# Altium project yard-ice-2.PrjPCB
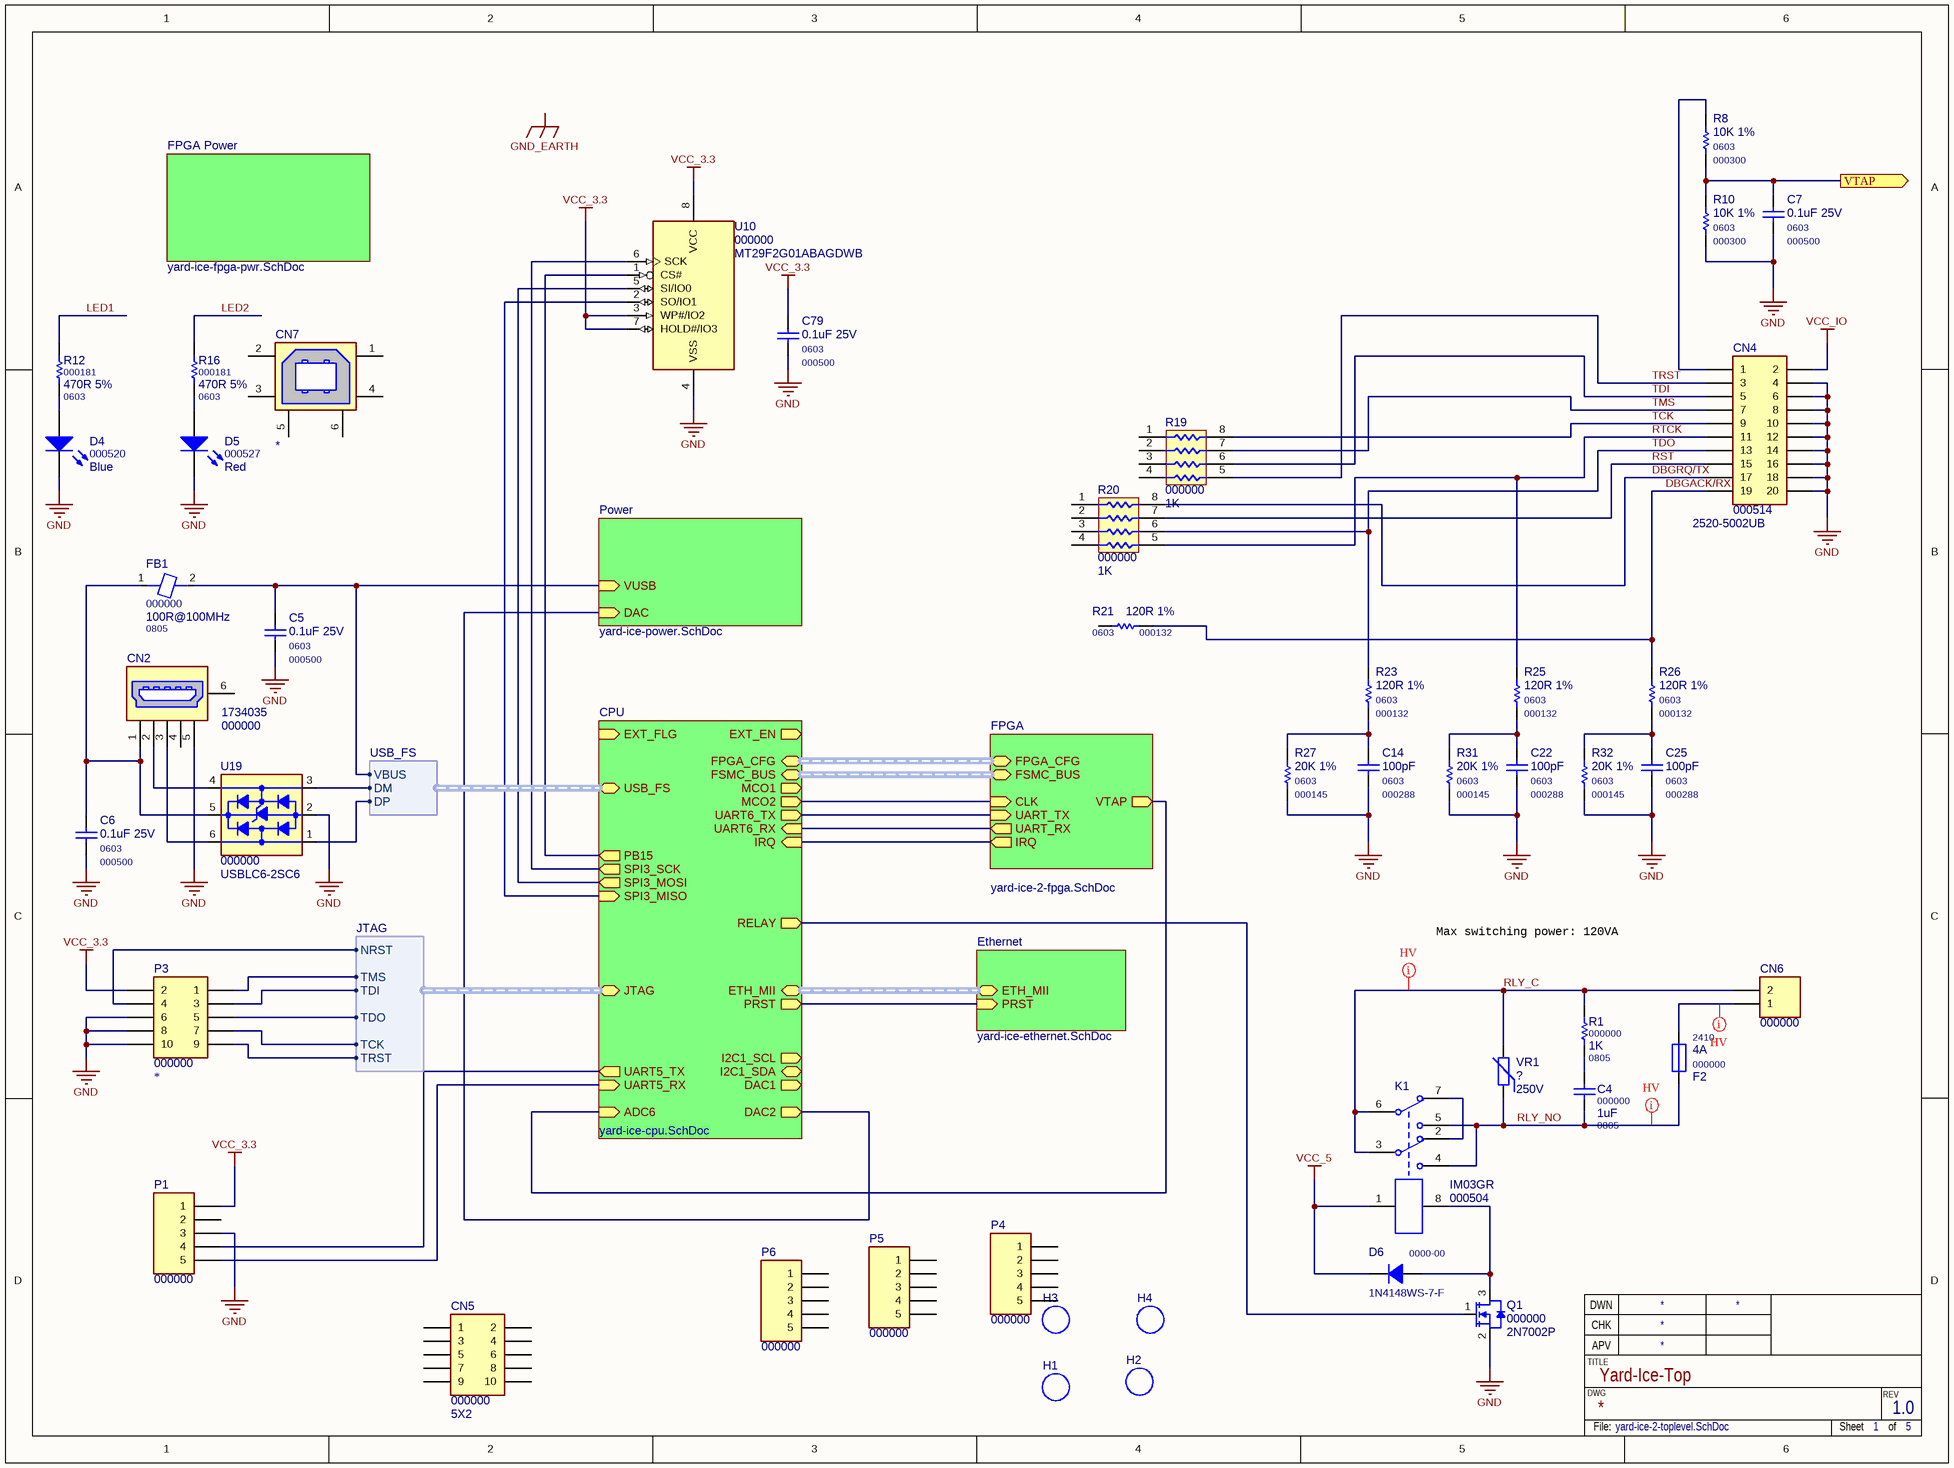
[diagram p0: yard-ice-2-toplevel.SchDoc]
5 sheets, 112 parts. Net scope: hierarchical (ports join the sheet entries above them; power ports are global).
Board file: yard-ice-2.PcbDoc
Sheets:
  yard-ice-2-toplevel.SchDoc
    CPU = yard-ice-cpu.SchDoc
    FPGA = yard-ice-2-fpga.SchDoc
    FPGA Power = yard-ice-fpga-pwr.SchDoc
  yard-ice-change-log.SchDoc

## Sheet yard-ice-2-toplevel.SchDoc: Yard-Ice-Top
size 365 x 274 mm; Revision: 1.0; SheetNumber: 1; SheetTotal: 5

### Parts
C4  000000  value 1uF  Package: 0805  [C0805HV]
C5  000500  value 0.1uF 25V  Package: 0603  [C0603M]
C6  000500  value 0.1uF 25V  Package: 0603  [C0603M]
C7  000500  value 0.1uF 25V  Package: 0603  [C0603M]
C14  000288  value 100pF  Package: 0603  [C0603M]
C22  000288  value 100pF  Package: 0603  [C0603M]
C25  000288  value 100pF  Package: 0603  [C0603M]
C79  000500  value 0.1uF 25V  Package: 0603  [C0603M]
CN2  value 1734035  [1734035]  (hidden comment: 000000)
CN4  000514  value 2520-5002UB  [TST-110-04-G-D-RA]
CN5  000000  value 5X2  [TST-105-04-G-D-RA]
CN6  000000  [691322110002]
CN7  *  [4-1734376]
D4  000520  value Blue  [LED0805L LP]
D5  000527  value Red  [LED0805L LP]
D6  0000-00  MF PN: 1N4148WS-7-F  [SOD-323-M]
F2  000000  value 4A  Package: 2410  [F2410]
FB1  000000  value 100R@100MHz  Package: 0805  [L0805M]
H1  Hole Non Plated  [Hole NP 3.2x5.0x5.0]  (value not drawn)
H2  Hole Non Plated  [Hole NP 3.2x5.0x5.0]  (value not drawn)
H3  Hole Non Plated  [Hole NP 3.2x5.0x5.0]  (value not drawn)
H4  Hole Non Plated  [Hole NP 3.2x5.0x5.0]  (value not drawn)
K1  000504  value IM03GR  [Relay-10X6]
P1  000000  [TSW-105-07-G-S]
P3  000000  [TSW-105-07-G-D]
P4  000000  [TSW-105-07-G-S]
P5  000000  [TSW-105-07-G-S]
P6  000000  [TSW-105-07-G-S]
Q1  000000  value 2N7002P  [SOT-23-M]
R1  000000  value 1K  Package: 0805  [R0805HV]
R8  000300  value 10K 1%  Package: 0603  [R0603M]
R10  000300  value 10K 1%  Package: 0603  [R0603M]
R12  000181  value 470R 5%  Package: 0603  [R0603M]
R16  000181  value 470R 5%  Package: 0603  [R0603M]
R19  000000  value 1K  [R0603x4L]
R20  000000  value 1K  [R0603x4L]
R21  000132  value 120R 1%  Package: 0603  [R0603M]
R23  000132  value 120R 1%  Package: 0603  [R0603M]
R25  000132  value 120R 1%  Package: 0603  [R0603M]
R26  000132  value 120R 1%  Package: 0603  [R0603M]
R27  000145  value 20K 1%  Package: 0603  [R0603M]
R31  000145  value 20K 1%  Package: 0603  [R0603M]
R32  000145  value 20K 1%  Package: 0603  [R0603M]
U10  000000  value MT29F2G01ABAGDWB  [U-PDFN-8]
U19  000000  value USBLC6-2SC6  [SOT23-6L]
VR1  ?  value 250V  [MOV7x4.8-5.0]

### Sub-sheets
CPU = yard-ice-cpu.SchDoc: ETH_MII (harness ETH_MII), FSMC_BUS (harness FSMC_BUS), FPGA_CFG (harness FPGA_CFG), PRST (out), MCO2 (out), USB_FS (harness USB_FS), JTAG (harness JTAG), EXT_EN (out), EXT_FLG (in), ADC6 (in), DAC2 (out), I2C1_SDA (bidir), I2C1_SCL (out), UART6_TX (out), UART6_RX (in), UART5_TX (out), UART5_RX (in), RELAY (out), IRQ (in), DAC1 (out), SPI3_MISO (in), SPI3_MOSI (out), SPI3_SCK (out), PB15 (out), MCO1 (out)
Ethernet = yard-ice-ethernet.SchDoc (file not in this document): ETH_MII (harness ETH_MII), PRST (in)
FPGA = yard-ice-2-fpga.SchDoc: FSMC_BUS (harness FSMC_BUS), FPGA_CFG (harness FPGA_CFG), CLK (in), VTAP (out), UART_TX (in), UART_RX (out), IRQ (out)
FPGA Power = yard-ice-fpga-pwr.SchDoc: no entries
Power = yard-ice-power.SchDoc (file not in this document): VUSB (in), DAC (in)

### Ports
VTAP (out)

### Harnesses
USB_FS: VBUS, DM, DP
JTAG: TDO, TDI, TCK, TMS, TRST, NRST

### Nets
GND: C5.2 C6.2 C7.2 C14.2 C22.2 C25.2 C79.2 CN2.5(SHIELD) CN4.4 CN4.6 CN4.8 CN4.10 CN4.12 CN4.14 CN4.16 CN4.18 CN4.20 D4.2(K) D5.2(K) P1.3 P3.6 P3.8 P3.10 Q1.2(S) R10.2 R27.2 R31.2 R32.2 U10.4(VSS) U19.2(GND)
VCC_3.3: C79.1 P1.1 P3.2 U10.3(WP#/IO2) U10.7(HOLD#/IO3) U10.8(VCC)
VCC_5: D6.2(K) K1.1
VCC_IO: CN4.2
ADC12_IN6: sheet CPU/ADC6, sheet FPGA/VTAP
DAC2_OUT: sheet Power/DAC, sheet CPU/DAC2
DBGACK/RX: CN4.19 R21.1 R26.1
DBGRQ/TX: CN4.17 R20.8
IRQ: sheet CPU/IRQ, sheet FPGA/IRQ
JTCK: P3.7 ; sheet CPU/JTAG.TCK
JTDI: P3.3 ; sheet CPU/JTAG.TDI
JTDO: P3.5 ; sheet CPU/JTAG.TDO
JTMS: P3.1 ; sheet CPU/JTAG.TMS
JTRST: P3.9 ; sheet CPU/JTAG.TRST
LED1: R12.1
LED2: R16.1
NRST: P3.4 ; sheet CPU/JTAG.NRST
OTG_FS_DM: U19.3(IO/2) ; sheet CPU/USB_FS.DM
OTG_FS_DP: U19.1(IO/1) ; sheet CPU/USB_FS.DP
OTG_FS_VBUS: C5.1 FB1.2 ; sheet Power/VUSB, sheet CPU/USB_FS.VBUS
PC13: sheet CPU/PRST, sheet Ethernet/PRST
RLY_C: CN6.2 K1.3 K1.6 R1.2 VR1.2
RLY_NO: C4.2 F2.1 K1.4 K1.5 VR1.1
RST: CN4.15 R20.7
RTCK: CN4.11 R20.5 R25.1
SDIO_CK: U10.5(SI/IO0) ; sheet CPU/SPI3_MOSI
SDIO_D1: sheet CPU/MCO2, sheet FPGA/CLK
SDIO_D2: U10.6(SCK) ; sheet CPU/SPI3_SCK
SDIO_D3: U10.2(SO/IO1) ; sheet CPU/SPI3_MISO
SPI2_NSS: Q1.1(G) ; sheet CPU/RELAY
TCK: CN4.9 R19.8
TDI: CN4.5 R19.6
TDO: CN4.13 R20.6 R23.1
TMS: CN4.7 R19.7
TRST: CN4.3 R19.5
USART6_RX: sheet CPU/UART6_RX, sheet FPGA/UART_RX
USART6_TX: sheet CPU/UART6_TX, sheet FPGA/UART_TX
NetC4_1: C4.1 R1.1
NetC6_1: C6.1 CN2.1 FB1.1 U19.5(VBUS)
NetC7_1: C7.1 R8.2 R10.1 ; port VTAP
NetC14_1: C14.1 R23.2 R27.1
NetC22_1: C22.1 R25.2 R31.1
NetC25_1: C25.1 R26.2 R32.1
NetCN2_2: CN2.2 U19.4(I/O2)
NetCN2_3: CN2.3 U19.6(I/O1)
NetCN4_1: CN4.1 R8.1
NetCN6_1: CN6.1 F2.2
NetD4_1: D4.1(A) R12.2
NetD5_1: D5.1(A) R16.2
NetD6_1: D6.1(A) K1.8 Q1.3(D)
NetK1_2: K1.2 K1.7
NetP1_4: P1.4 ; sheet CPU/UART5_TX
NetP1_5: P1.5 ; sheet CPU/UART5_RX
NetU10_1: U10.1(CS#) ; sheet CPU/PB15

Not connected (* = marked no-connect by the designer): CN2 4 6(SHIELD); CN5 1 2 3 4 5 6 7 8 9 10; CN7 1 2 3 4 5(SHIELD) 6(SHIELD); P1 2; P4 1 2 3 4 5; P5 1 2 3 4 5; P6 1 2 3 4 5; R19 1 2 3 4; R20 1 2 3 4; R21 2

### Buses and harness runs
harness sheet CPU/ETH_MII = sheet Ethernet/ETH_MII
harness sheet CPU/FPGA_CFG = sheet FPGA/FPGA_CFG
harness sheet CPU/FSMC_BUS = sheet FPGA/FSMC_BUS

### Layout directives
net class HV: NetCN6_1, RLY_C, RLY_NO

### Notes on the sheet
- Max switching power: 120VA
- Labels drawn without touching a wire or pin: GND_EARTH
- TITLE
- CHK
- DWN
- APV
- DWG
- REV
- File:
- Sheet
- of

### Library data of the parts
C4 = C0805: SMD Ceramic Chip Capacitor - 0805; PN: 000000; ExtraInfo: *
C5-C7 C79 = C0603: SMD Ceramic Chip Capacitor - 0603 - X7R; MF PN: C1608X7R1E104K; MF: TDK; PN: 000500
C14 C22 C25 = C0603: SMD Ceramic Chip Capacitor - 0603; PN: 000288
CN2 = 1734035: USB Type B Mini - Right Angle - SMD; MF: Tyco; MF PN: 1734035-3; Package: SMT; PN: 000000; Digi-Key PN: A121553CT-ND; Price: 1.16131; Status: Stock
CN4 = Header 10X2: Shrouded Header, 20 Pos, Right Angle; MF: 3M; PN: 000514; Package: PTH; MF PN: 2520-5002UB
CN5 = Header 5X2: Socket 5-Pin, Dual row; MF: Samtec; PN: 000000; Package: SMD; ExtraInfo: *
CN6 = Term Blk 2: Terminal Block, Header, 2-Pos; PN: 000000; Package: PTH; Value: *; ExtraInfo: *
CN7 = 4-1734376: USB Type B - Right Angle - Thru Hole; PN: *; Value: *; Package: *; ExtraInfo: *
D4 D5 = LED0805LP: LED SMD 0805; Package: 0805
  D4: PN: 000520
  D5: PN: 000527
D6 = 1N4148WS: Fast Switching Diode 100V 150mA; MF: Diodes Inc; PN: 0000-00; Package: SOD-323; ExtraInfo: *
F2 = F2410: PN: 000000; ExtraInfo: *; MF: *; MF PN: *
FB1 = FB0805: SMD Chip Ferrite Bead - 0805; PN: 000000; ExtraInfo: *; MF: *; MF PN: *
K1 = Relay-DPDT: Dual-Pole Dual-Throw Relay; MF: Tyco; PN: 000504; Package: SMT; MF PN: IM03GR
P1 P4-P6 = Header 5: Header, 5-Pin; Value: 5x1; PN: 000000; Package: PTH
P3 = Header 5X2: Socket 5-Pin, Dual row; PN: 000000; Package: SMD; Value: *; ExtraInfo: *
Q1 = 2N7002P: N-Channel MOSFET 60V 360mA SOT-23; PN: 000000; Package: SOT-23; ExtraInfo: *
R1 = R0805: SMD Chip Resistor - 0805; PN: 000000; ExtraInfo: *
R8 R10 R12 R16 R21 R23 R25-R27 R31 R32 = R0603: SMD Chip Resistor - 0603
  R8 R10: PN: 000300
  R12 R16: PN: 000181
  R21 R23 R25 R26: PN: 000132
  R27 R31 R32: PN: 000145
R19 R20 = R0603x4: SMD Chip Resistor Array - 4x0603; PackageReference: 4x0402; PN: 000000; ExtraInfo: *; Package: 0603
U10 = MT29F2G01ABAGDWB: 2Gb NANDl Flash Memory,  133MHz, SPI; MF: Micron; MF PN: MT29F2G01ABAGDWB-IT:G TR; PN: 000000; Package: 8VDFN; ExtraInfo: *; Digi-Key PN: 557-1664-1-ND; Price: 3.52500
U19 = USBLC6-2SC6: USB ESD Protection; PN: 0000-00; MF: STMicroelectronics; Package: ST23-6L; ExtraInfo: *; Digi-Key PN: 497-5235-1-ND; MF PN: USBLC6-2SC6; Price: 0.14025; Status: Stock
VR1 = Varistor: Varistor (Voltage-Sensitive Resistor); PN: ?; MF PN: *; Package: PTH; ExtraInfo: *; MF: *; Price: *; Digi-Key PN: *

## Sheet yard-ice-cpu.SchDoc: Yard-Ice-CPU
size 365 x 274 mm; Revision: 1.0; SheetNumber: 3; SheetTotal: 5
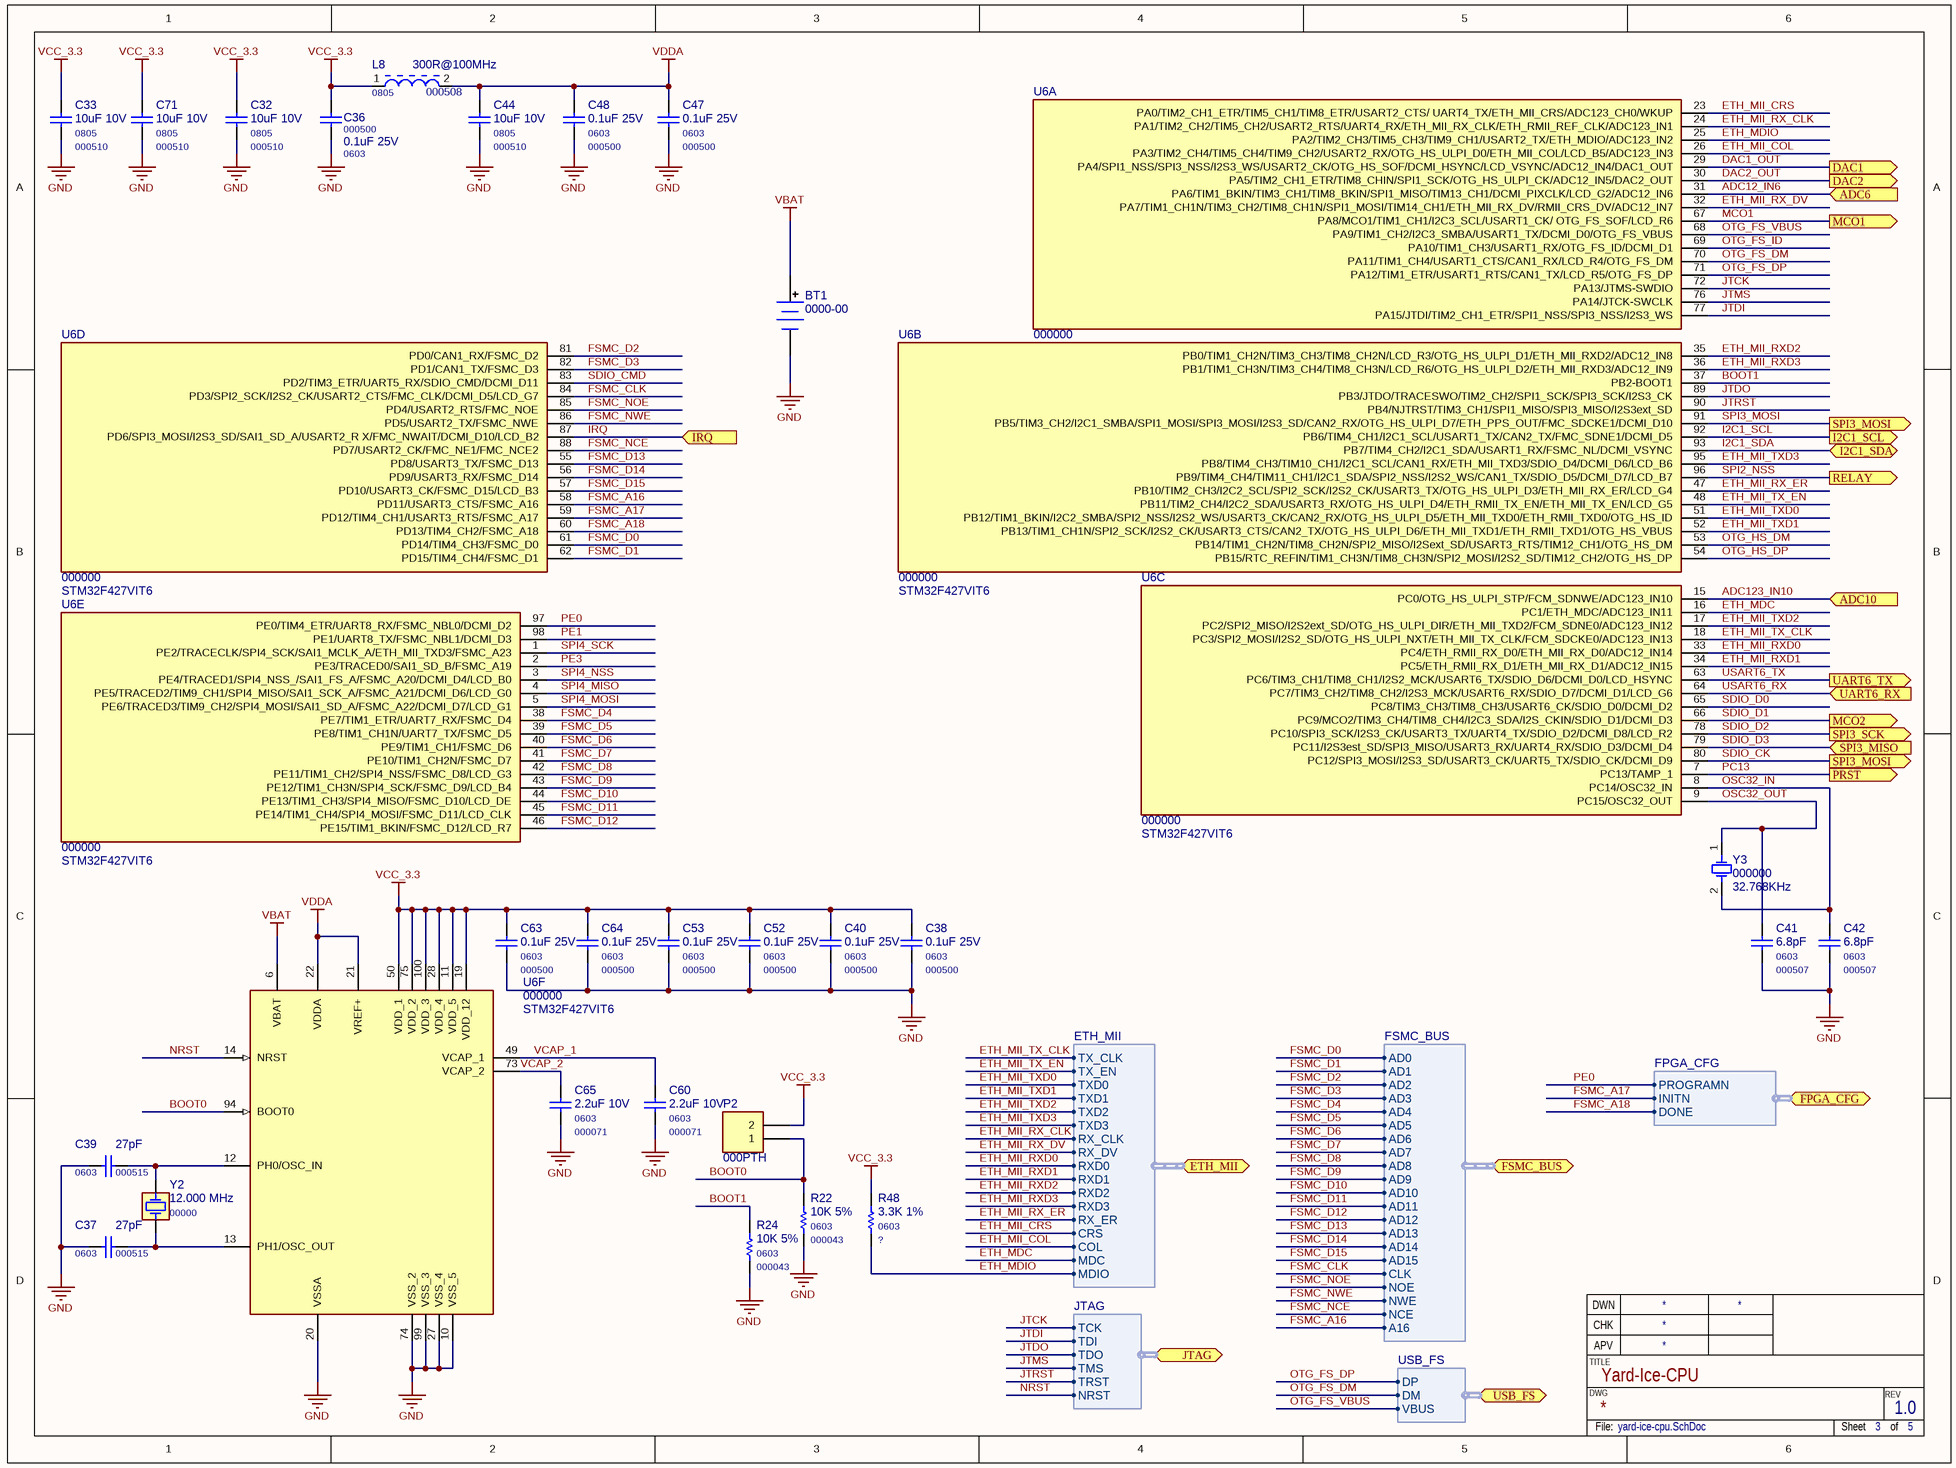
[diagram p1: yard-ice-cpu.SchDoc]

### Parts
BT1  0000-00  [CR-1632/VCN]
C32  000510  value 10uF 10V  Package: 0805  [C0805M]
C33  000510  value 10uF 10V  Package: 0805  [C0805M]
C36  000500  value 0.1uF 25V  Package: 0603  [C0603M]
C37  000515  value 27pF  Package: 0603  [C0603M]
C38  000500  value 0.1uF 25V  Package: 0603  [C0603M]
C39  000515  value 27pF  Package: 0603  [C0603M]
C40  000500  value 0.1uF 25V  Package: 0603  [C0603M]
C41  000507  value 6.8pF  Package: 0603  [C0603M]
C42  000507  value 6.8pF  Package: 0603  [C0603M]
C44  000510  value 10uF 10V  Package: 0805  [C0805M]
C47  000500  value 0.1uF 25V  Package: 0603  [C0603M]
C48  000500  value 0.1uF 25V  Package: 0603  [C0603M]
C52  000500  value 0.1uF 25V  Package: 0603  [C0603M]
C53  000500  value 0.1uF 25V  Package: 0603  [C0603M]
C60  000071  value 2.2uF 10V  Package: 0603  [C0603M]
C63  000500  value 0.1uF 25V  Package: 0603  [C0603M]
C64  000500  value 0.1uF 25V  Package: 0603  [C0603M]
C65  000071  value 2.2uF 10V  Package: 0603  [C0603M]
C71  000510  value 10uF 10V  Package: 0805  [C0805M]
L8  000508  value 300R@100MHz  Package: 0805  [L0805M]
P2  000PTH  [TSW-102-07-G-S]
R22  000043  value 10K 5%  Package: 0603  [R0603M]
R24  000043  value 10K 5%  Package: 0603  [R0603M]
R48  ?  value 3.3K 1%  Package: 0603  [R0603M]
U6  000000  value STM32F427VIT6  [LQFP100]  (parts A,B,C,D,E,F of 6)
Y2  00000  value 12.000 MHz  [ABM3-H]
Y3  000000  value 32.768KHz  [CA-301-V]

### Ports
ADC6 (in), ADC10 (in), DAC1 (out), DAC2 (out), ETH_MII (harness ETH_MII), FPGA_CFG (harness FPGA_CFG), FSMC_BUS (harness FSMC_BUS), I2C1_SCL (out), I2C1_SDA (bidir), IRQ (in), JTAG (harness JTAG), MCO1 (out), MCO2 (out), PRST (out), RELAY (out), SPI3_MISO (in), SPI3_MOSI (out), SPI3_SCK (out), UART6_RX (in), UART6_TX (out), USB_FS (harness USB_FS)

### Harnesses
ETH_MII: TX_CLK, TX_EN, TXD0, TXD1, TXD2, TXD3, RX_CLK, RX_DV, RXD0, RXD1, RXD2, RXD3, RX_ER, CRS, COL, MDC, MDIO
FSMC_BUS: AD0, AD1, AD2, AD3, AD4, AD5, AD6, AD7, AD8, AD9, AD10, AD11, AD12, AD13, AD14, AD15, CLK, NOE, NWE, NCE, A16
USB_FS: VBUS, DM, DP
JTAG: TDO, TDI, TCK, TMS, TRST, NRST
FPGA_CFG: DONE, INITN, PROGRAMN

### Nets
GND: BT1.2(-) C32.2 C33.2 C36.2 C37.1 C38.2 C39.1 C40.2 C41.1 C42.1 C44.2 C47.2 C48.2 C52.2 C53.2 C60.2 C63.2 C64.2 C65.2 C71.2 R22.1 R24.1 U6.10(VSS_5) U6.20(VSSA) U6.27(VSS_4) U6.74(VSS_2) U6.99(VSS_3)
VBAT: BT1.1(+) U6.6(VBAT)
VCC_3.3: C32.1 C33.1 C36.1 C38.1 C40.1 C52.1 C53.1 C63.1 C64.1 C71.1 L8.1 P2.2 R48.2 U6.11(VDD_5) U6.19(VDD_12) U6.28(VDD_4) U6.50(VDD_1) U6.75(VDD_2) U6.100(VDD_3)
VDDA: C44.1 C47.1 C48.1 L8.2 U6.21(VREF+) U6.22(VDDA)
ADC12_IN6: U6.31(PA6/TIM1_BKIN/TIM3_CH1/TIM8_BKIN/SPI1_MISO/TIM13_CH1/DCMI_PIXCLK/LCD_G2/ADC12_IN6) ; port ADC6
ADC123_IN10: U6.15(PC0/OTG_HS_ULPI_STP/FCM_SDNWE/ADC123_IN10) ; port ADC10
BOOT0: P2.1 R22.2 U6.94(BOOT0)
BOOT1: R24.2 U6.37(PB2-BOOT1)
DAC1_OUT: U6.29(PA4/SPI1_NSS/SPI3_NSS/I2S3_WS/USART2_CK/OTG_HS_SOF/DCMI_HSYNC/LCD_VSYNC/ADC12_IN4/DAC1_OUT) ; port DAC1
DAC2_OUT: U6.30(PA5/TIM2_CH1_ETR/TIM8_CHIN/SPI1_SCK/OTG_HS_ULPI_CK/ADC12_IN5/DAC2_OUT) ; port DAC2
ETH_MDC: U6.16(PC1/ETH_MDC/ADC123_IN11) ; port ETH_MII.MDC
ETH_MDIO: R48.1 U6.25(PA2/TIM2_CH3/TIM5_CH3/TIM9_CH1/USART2_TX/ETH_MDIO/ADC123_IN2) ; port ETH_MII.MDIO
ETH_MII_COL: U6.26(PA3/TIM2_CH4/TIM5_CH4/TIM9_CH2/USART2_RX/OTG_HS_ULPI_D0/ETH_MII_COL/LCD_B5/ADC123_IN3) ; port ETH_MII.COL
ETH_MII_CRS: U6.23(PA0/TIM2_CH1_ETR/TIM5_CH1/TIM8_ETR/USART2_CTS/_UART4_TX/ETH_MII_CRS/ADC123_CH0/WKUP) ; port ETH_MII.CRS
ETH_MII_RX_CLK: U6.24(PA1/TIM2_CH2/TIM5_CH2/USART2_RTS/UART4_RX/ETH_MII_RX_CLK/ETH_RMII_REF_CLK/ADC123_IN1) ; port ETH_MII.RX_CLK
ETH_MII_RX_DV: U6.32(PA7/TIM1_CH1N/TIM3_CH2/TIM8_CH1N/SPI1_MOSI/TIM14_CH1/ETH_MII_RX_DV/RMII_CRS_DV/ADC12_IN7) ; port ETH_MII.RX_DV
ETH_MII_RX_ER: U6.47(PB10/TIM2_CH3/I2C2_SCL/SPI2_SCK/I2S2_CK/USART3_TX/OTG_HS_ULPI_D3/ETH_MII_RX_ER/LCD_G4) ; port ETH_MII.RX_ER
ETH_MII_RXD0: U6.33(PC4/ETH_RMII_RX_D0/ETH_MII_RX_D0/ADC12_IN14) ; port ETH_MII.RXD0
ETH_MII_RXD1: U6.34(PC5/ETH_RMII_RX_D1/ETH_MII_RX_D1/ADC12_IN15) ; port ETH_MII.RXD1
ETH_MII_RXD2: U6.35(PB0/TIM1_CH2N/TIM3_CH3/TIM8_CH2N/LCD_R3/OTG_HS_ULPI_D1/ETH_MII_RXD2/ADC12_IN8) ; port ETH_MII.RXD2
ETH_MII_RXD3: U6.36(PB1/TIM1_CH3N/TIM3_CH4/TIM8_CH3N/LCD_R6/OTG_HS_ULPI_D2/ETH_MII_RXD3/ADC12_IN9) ; port ETH_MII.RXD3
ETH_MII_TX_CLK: U6.18(PC3/SPI2_MOSI/I2S2_SD/OTG_HS_ULPI_NXT/ETH_MII_TX_CLK/FCM_SDCKE0/ADC123_IN13) ; port ETH_MII.TX_CLK
ETH_MII_TX_EN: U6.48(PB11/TIM2_CH4/I2C2_SDA/USART3_RX/OTG_HS_ULPI_D4/ETH_RMII_TX_EN/ETH_MII_TX_EN/LCD_G5) ; port ETH_MII.TX_EN
ETH_MII_TXD0: U6.51(PB12/TIM1_BKIN/I2C2_SMBA/SPI2_NSS/I2S2_WS/USART3_CK/CAN2_RX/OTG_HS_ULPI_D5/ETH_MII_TXD0/ETH_RMII_TXD0/OTG_HS_ID) ; port ETH_MII.TXD0
ETH_MII_TXD1: U6.52(PB13/TIM1_CH1N/SPI2_SCK/I2S2_CK/USART3_CTS/CAN2_TX/OTG_HS_ULPI_D6/ETH_MII_TXD1/ETH_RMII_TXD1/OTG_HS_VBUS) ; port ETH_MII.TXD1
ETH_MII_TXD2: U6.17(PC2/SPI2_MISO/I2S2ext_SD/OTG_HS_ULPI_DIR/ETH_MII_TXD2/FCM_SDNE0/ADC123_IN12) ; port ETH_MII.TXD2
ETH_MII_TXD3: U6.95(PB8/TIM4_CH3/TIM10_CH1/I2C1_SCL/CAN1_RX/ETH_MII_TXD3/SDIO_D4/DCMI_D6/LCD_B6) ; port ETH_MII.TXD3
FSMC_A16: U6.58(PD11/USART3_CTS/FSMC_A16) ; port FSMC_BUS.A16
FSMC_A17: U6.59(PD12/TIM4_CH1/USART3_RTS/FSMC_A17) ; port FPGA_CFG.INITN  [project net CFG_INIT]
FSMC_A18: U6.60(PD13/TIM4_CH2/FSMC_A18) ; port FPGA_CFG.DONE  [project net CFG_DONE]
FSMC_CLK: U6.84(PD3/SPI2_SCK/I2S2_CK/USART2_CTS/FMC_CLK/DCMI_D5/LCD_G7) ; port FSMC_BUS.CLK
FSMC_D0: U6.61(PD14/TIM4_CH3/FSMC_D0) ; port FSMC_BUS.AD0
FSMC_D1: U6.62(PD15/TIM4_CH4/FSMC_D1) ; port FSMC_BUS.AD1
FSMC_D2: U6.81(PD0/CAN1_RX/FSMC_D2) ; port FSMC_BUS.AD2
FSMC_D3: U6.82(PD1/CAN1_TX/FSMC_D3) ; port FSMC_BUS.AD3
FSMC_D4: U6.38(PE7/TIM1_ETR/UART7_RX/FSMC_D4) ; port FSMC_BUS.AD4
FSMC_D5: U6.39(PE8/TIM1_CH1N/UART7_TX/FSMC_D5) ; port FSMC_BUS.AD5
FSMC_D6: U6.40(PE9/TIM1_CH1/FSMC_D6) ; port FSMC_BUS.AD6
FSMC_D7: U6.41(PE10/TIM1_CH2N/FSMC_D7) ; port FSMC_BUS.AD7
FSMC_D8: U6.42(PE11/TIM1_CH2/SPI4_NSS/FSMC_D8/LCD_G3) ; port FSMC_BUS.AD8
FSMC_D9: U6.43(PE12/TIM1_CH3N/SPI4_SCK/FSMC_D9/LCD_B4) ; port FSMC_BUS.AD9
FSMC_D10: U6.44(PE13/TIM1_CH3/SPI4_MISO/FSMC_D10/LCD_DE) ; port FSMC_BUS.AD10
FSMC_D11: U6.45(PE14/TIM1_CH4/SPI4_MOSI/FSMC_D11/LCD_CLK) ; port FSMC_BUS.AD11
FSMC_D12: U6.46(PE15/TIM1_BKIN/FSMC_D12/LCD_R7) ; port FSMC_BUS.AD12
FSMC_D13: U6.55(PD8/USART3_TX/FSMC_D13) ; port FSMC_BUS.AD13
FSMC_D14: U6.56(PD9/USART3_RX/FSMC_D14) ; port FSMC_BUS.AD14
FSMC_D15: U6.57(PD10/USART3_CK/FSMC_D15/LCD_B3) ; port FSMC_BUS.AD15
FSMC_NCE: U6.88(PD7/USART2_CK/FMC_NE1/FMC_NCE2) ; port FSMC_BUS.NCE
FSMC_NOE: U6.85(PD4/USART2_RTS/FMC_NOE) ; port FSMC_BUS.NOE
FSMC_NWE: U6.86(PD5/USART2_TX/FSMC_NWE) ; port FSMC_BUS.NWE
I2C1_SCL: U6.92(PB6/TIM4_CH1/I2C1_SCL/USART1_TX/CAN2_TX/FMC_SDNE1/DCMI_D5) ; port I2C1_SCL
I2C1_SDA: U6.93(PB7/TIM4_CH2/I2C1_SDA/USART1_RX/FSMC_NL/DCMI_VSYNC) ; port I2C1_SDA
IRQ: U6.87(PD6/SPI3_MOSI/I2S3_SD/SAI1_SD_A/USART2_R_X/FMC_NWAIT/DCMI_D10/LCD_B2) ; port IRQ
JTCK: U6.72(PA13/JTMS-SWDIO) ; port JTAG.TCK
JTDI: U6.77(PA15/JTDI/TIM2_CH1_ETR/SPI1_NSS/SPI3_NSS/I2S3_WS) ; port JTAG.TDI
JTDO: U6.89(PB3/JTDO/TRACESWO/TIM2_CH2/SPI1_SCK/SPI3_SCK/I2S3_CK) ; port JTAG.TDO
JTMS: U6.76(PA14/JTCK-SWCLK) ; port JTAG.TMS
JTRST: U6.90(PB4/NJTRST/TIM3_CH1/SPI1_MISO/SPI3_MISO/I2S3ext_SD) ; port JTAG.TRST
MCO1: U6.67(PA8/MCO1/TIM1_CH1/I2C3_SCL/USART1_CK/_OTG_FS_SOF/LCD_R6) ; port MCO1
NRST: U6.14(NRST) ; port JTAG.NRST
OSC32_IN: C42.2 U6.8(PC14/OSC32_IN) Y3.2
OSC32_OUT: C41.2 U6.9(PC15/OSC32_OUT) Y3.1
OTG_FS_DM: U6.70(PA11/TIM1_CH4/USART1_CTS/CAN1_RX/LCD_R4/OTG_FS_DM) ; port USB_FS.DM
OTG_FS_DP: U6.71(PA12/TIM1_ETR/USART1_RTS/CAN1_TX/LCD_R5/OTG_FS_DP) ; port USB_FS.DP
OTG_FS_ID: U6.69(PA10/TIM1_CH3/USART1_RX/OTG_FS_ID/DCMI_D1)
OTG_FS_VBUS: U6.68(PA9/TIM1_CH2/I2C3_SMBA/USART1_TX/DCMI_D0/OTG_FS_VBUS) ; port USB_FS.VBUS
OTG_HS_DM: U6.53(PB14/TIM1_CH2N/TIM8_CH2N/SPI2_MISO/I2Sext_SD/USART3_RTS/TIM12_CH1/OTG_HS_DM)
OTG_HS_DP: U6.54(PB15/RTC_REFIN/TIM1_CH3N/TIM8_CH3N/SPI2_MOSI/I2S2_SD/TIM12_CH2/OTG_HS_DP)
PC13: U6.7(PC13/TAMP_1) ; port PRST
PE0: U6.97(PE0/TIM4_ETR/UART8_RX/FSMC_NBL0/DCMI_D2) ; port FPGA_CFG.PROGRAMN  [project net CFG_PGMN]
PE1: U6.98(PE1/UART8_TX/FSMC_NBL1/DCMI_D3)
PE3: U6.2(PE3/TRACED0/SAI1_SD_B/FSMC_A19)
SDIO_CK: U6.80(PC12/SPI3_MOSI/I2S3_SD/USART3_CK/UART5_TX/SDIO_CK/DCMI_D9) U6.91(PB5/TIM3_CH2/I2C1_SMBA/SPI1_MOSI/SPI3_MOSI/I2S3_SD/CAN2_RX/OTG_HS_ULPI_D7/ETH_PPS_OUT/FMC_SDCKE1/DCMI_D10) ; port SPI3_MOSI  [also labelled SPI3_MOSI]
SDIO_CMD: U6.83(PD2/TIM3_ETR/UART5_RX/SDIO_CMD/DCMI_D11)
SDIO_D0: U6.65(PC8/TIM3_CH3/TIM8_CH3/USART6_CK/SDIO_D0/DCMI_D2)
SDIO_D1: U6.66(PC9/MCO2/TIM3_CH4/TIM8_CH4/I2C3_SDA/I2S_CKIN/SDIO_D1/DCMI_D3) ; port MCO2
SDIO_D2: U6.78(PC10/SPI3_SCK/I2S3_CK/USART3_TX/UART4_TX/SDIO_D2/DCMI_D8/LCD_R2) ; port SPI3_SCK
SDIO_D3: U6.79(PC11/I2S3est_SD/SPI3_MISO/USART3_RX/UART4_RX/SDIO_D3/DCMI_D4) ; port SPI3_MISO
SPI2_NSS: U6.96(PB9/TIM4_CH4/TIM11_CH1/I2C1_SDA/SPI2_NSS/I2S2_WS/CAN1_TX/SDIO_D5/DCMI_D7/LCD_B7) ; port RELAY
SPI4_MISO: U6.4(PE5/TRACED2/TIM9_CH1/SPI4_MISO/SAI1_SCK_A/FSMC_A21/DCMI_D6/LCD_G0)
SPI4_MOSI: U6.5(PE6/TRACED3/TIM9_CH2/SPI4_MOSI/SAI1_SD_A/FSMC_A22/DCMI_D7/LCD_G1)
SPI4_NSS: U6.3(PE4/TRACED1/SPI4_NSS_/SAI1_FS_A/FSMC_A20/DCMI_D4/LCD_B0)
SPI4_SCK: U6.1(PE2/TRACECLK/SPI4_SCK/SAI1_MCLK_A/ETH_MII_TXD3/FSMC_A23)
USART6_RX: U6.64(PC7/TIM3_CH2/TIM8_CH2/I2S3_MCK/USART6_RX/SDIO_D7/DCMI_D1/LCD_G6) ; port UART6_RX
USART6_TX: U6.63(PC6/TIM3_CH1/TIM8_CH1/I2S2_MCK/USART6_TX/SDIO_D6/DCMI_D0/LCD_HSYNC) ; port UART6_TX
VCAP_1: C60.1 U6.49(VCAP_1)
VCAP_2: C65.1 U6.73(VCAP_2)
NetC37_2: C37.2 U6.13(PH1/OSC_OUT) Y2.2
NetC39_2: C39.2 U6.12(PH0/OSC_IN) Y2.1

### Notes on the sheet
- TITLE
- CHK
- DWN
- APV
- DWG
- REV
- File:
- Sheet
- of

### Library data of the parts
BT1 = CR-1632/VCN: PTH 16mm SMD Battery Vertical; MF: Panasonic; PN: 0000-00; ExtraInfo: *; Value: CR-1632/VCN; Package: *; Class: Battery; MF PN: CR-1632/VCN
C32 C33 C71 = C0805: SMD Ceramic Chip Capacitor - 0805 - X7R; MF PN: C2012X7R1A106K; PN: TDK; PN: 000510; MF: TDK
C36 C38 C40 C47 C48 C52 C53 C63 C64 = C0603: as C5 on sheet yard-ice-2-toplevel; PN: 000500
C37 C39 C41 C42 = C0603: SMD Ceramic Chip Capacitor - 0603
  C37 C39: PN: 000515
  C41 C42: PN: 000507
C44 = C0805: SMD Ceramic Chip Capacitor - 0805 - X7R; MF PN: C2012X7R1A106K; MF: TDK; PN: 000510
C60 C65 = C0603: SMD Ceramic Chip Capacitor - 0603 - X7R; MF: Taiyo Yuden; MF PN: LMK107B7225KA-T; PN: 000071
L8 = L0805: SMD Ferrite Bead 0805; MF PN: MMZ2012Y301B; MF: TDK; PN: 000508
P2 = Header 2: Header, 2-Pin; Value: 2x1; PN: 000PTH; Package: PTH
R22 R24 R48 = R0603: SMD Chip Resistor - 0603
  R22 R24: PN: 000043
  R48: PN: ?
U6 = STM32F427VIT6: ARM Cortex-M4,  2MB Flash, 256+4KB RAM; Package: LQFP100; PN: 000000; ExtraInfo: *
Y2 = ABM3: Miniature Ceramic SMD Crystal; MF: Abracon; MF PN: ABM3-12.000MHZ-B2-T; Package: ABM3; PN: 00000
Y3 = CA-301: Cylinder Crystal Unit; MF: Epson; PN: 000000; ExtraInfo: *

## Sheet yard-ice-2-fpga.SchDoc: Yard-Ice-FPGA
size 365 x 274 mm; Revision: 1.0; SheetNumber: 4; SheetTotal: 5
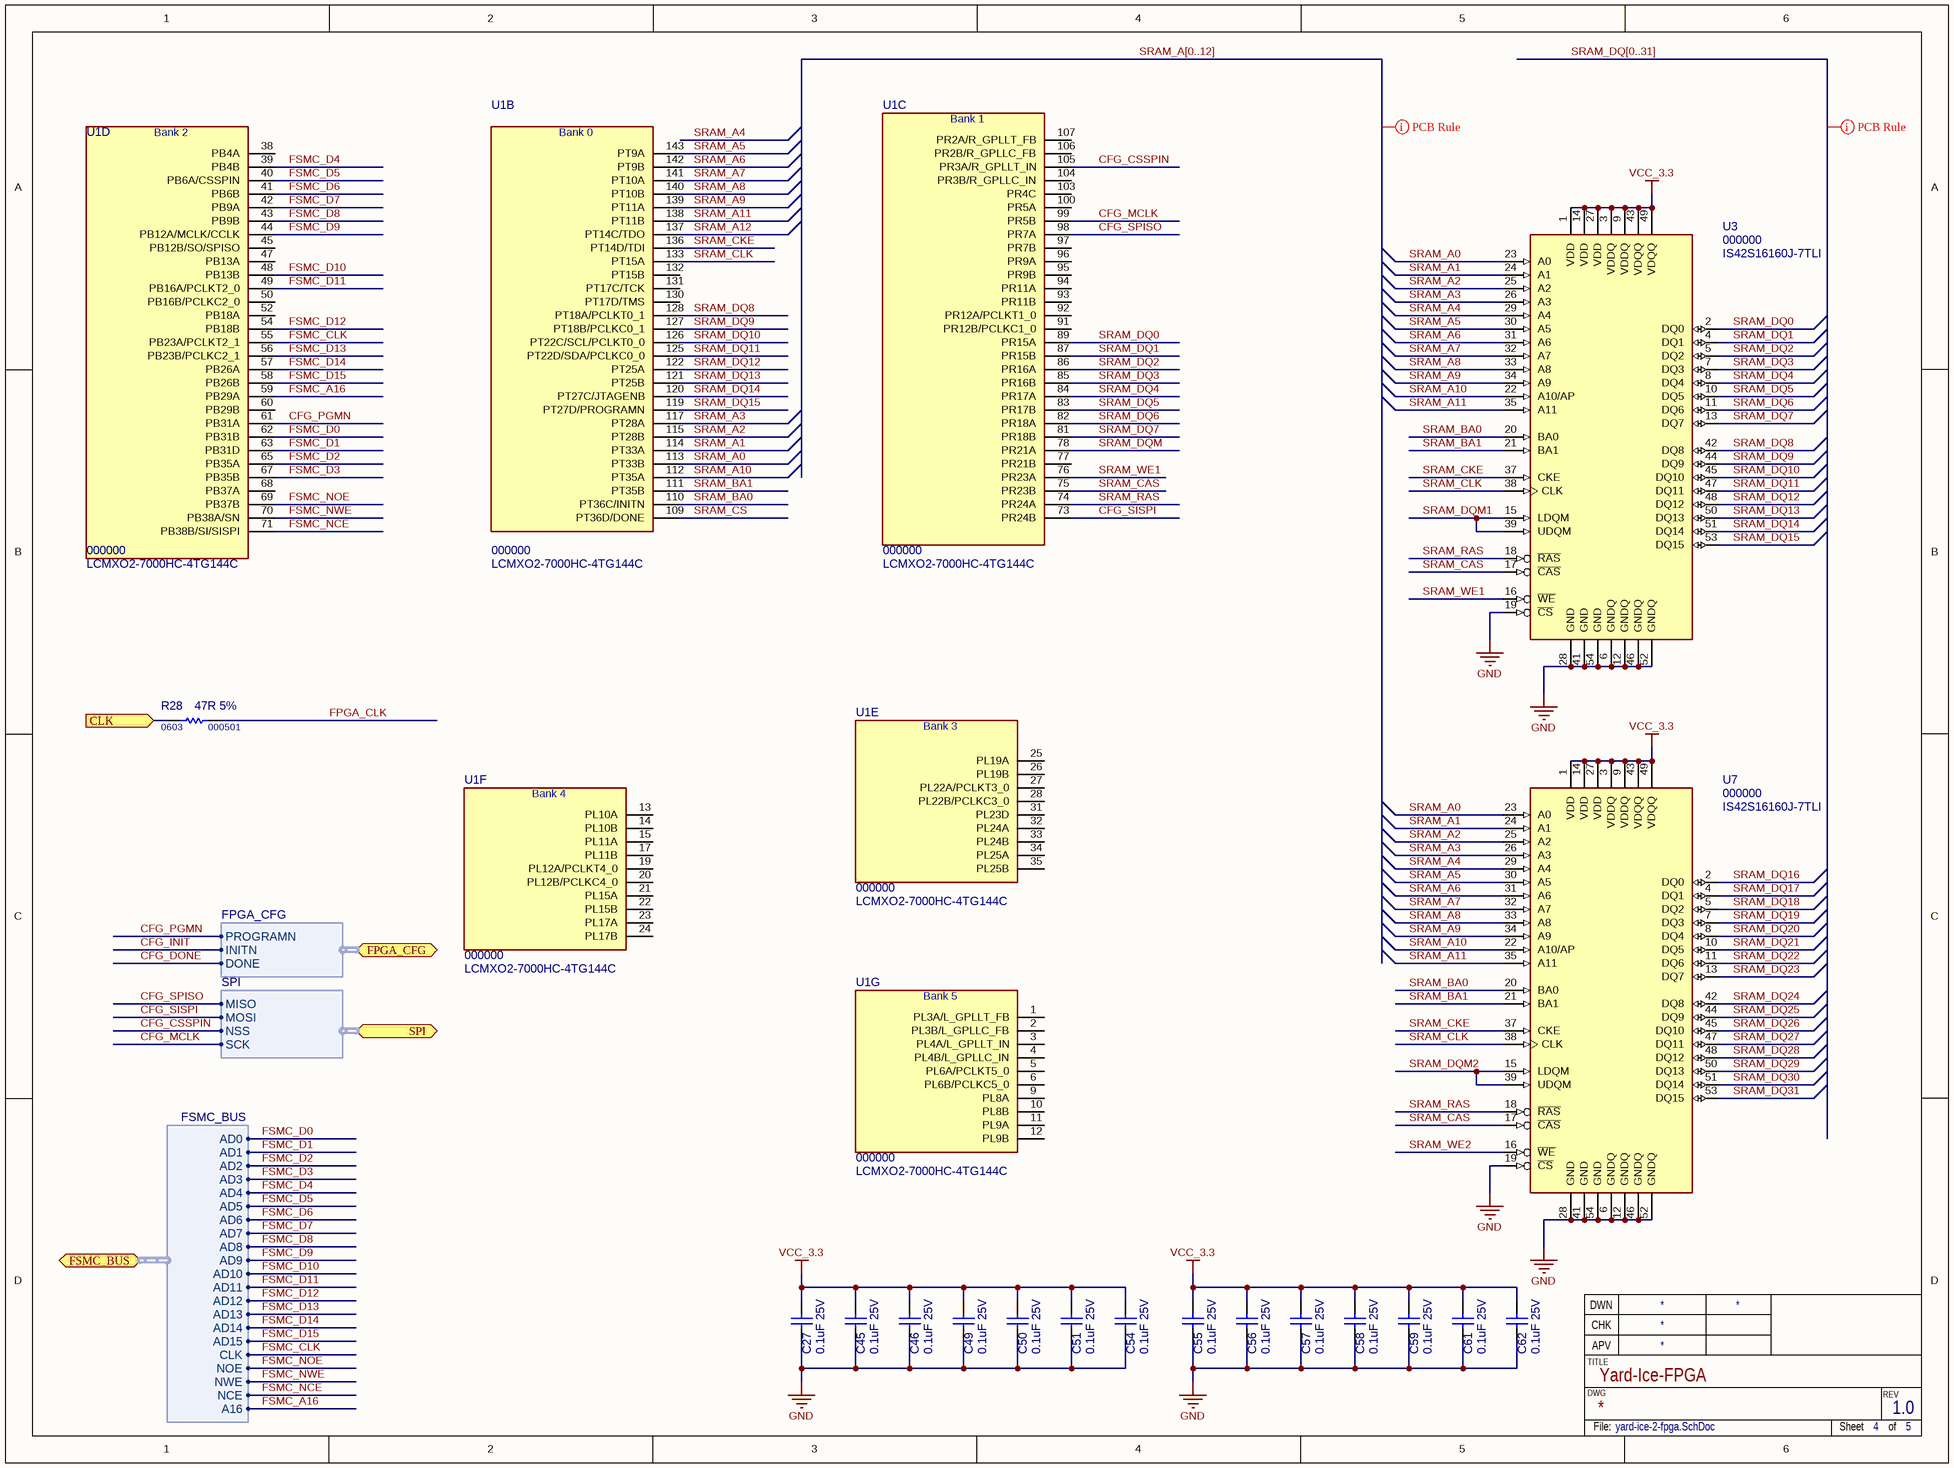
[diagram p2: yard-ice-2-fpga.SchDoc]

### Parts
C27  value 0.1uF 25V  [C0603M]  (hidden comment: 000500)
C45  value 0.1uF 25V  [C0603M]  (hidden comment: 000500)
C46  value 0.1uF 25V  [C0603M]  (hidden comment: 000500)
C49  value 0.1uF 25V  [C0603M]  (hidden comment: 000500)
C50  value 0.1uF 25V  [C0603M]  (hidden comment: 000500)
C51  value 0.1uF 25V  [C0603M]  (hidden comment: 000500)
C54  value 0.1uF 25V  [C0603M]  (hidden comment: 000500)
C55  value 0.1uF 25V  [C0603M]  (hidden comment: 000500)
C56  value 0.1uF 25V  [C0603M]  (hidden comment: 000500)
C57  value 0.1uF 25V  [C0603M]  (hidden comment: 000500)
C58  value 0.1uF 25V  [C0603M]  (hidden comment: 000500)
C59  value 0.1uF 25V  [C0603M]  (hidden comment: 000500)
C61  value 0.1uF 25V  [C0603M]  (hidden comment: 000500)
C62  value 0.1uF 25V  [C0603M]  (hidden comment: 000500)
R28  000501  value 47R 5%  Package: 0603  [R0603M]
U1  000000  value LCMXO2-7000HC-4TG144C  [144-TQFP]  (parts B,C,D,E,F,G of 7)
U3  000000  value IS42S16160J-7TLI  [TSOP-54-II]
U7  000000  value IS42S16160J-7TLI  [TSOP-54-II]

### Ports
CLK (in), FPGA_CFG (harness FPGA_CFG), FSMC_BUS (harness FSMC_BUS), SPI (harness SPI)

### Harnesses
FSMC_BUS: AD0, AD1, AD2, AD3, AD4, AD5, AD6, AD7, AD8, AD9, AD10, AD11, AD12, AD13, AD14, AD15, CLK, NOE, NWE, NCE, A16
FPGA_CFG: DONE, INITN, PROGRAMN
SPI: NSS, MOSI, MISO, SCK

### Nets
GND: C27.2 C45.2 C46.2 C49.2 C50.2 C51.2 C54.2 C55.2 C56.2 C57.2 C58.2 C59.2 C61.2 C62.2 U3.6(GNDQ) U3.12(GNDQ) U3.19(~{CS}) U3.28(GND) U3.41(GND) U3.46(GNDQ) U3.52(GNDQ) U3.54(GND) U7.6(GNDQ) U7.12(GNDQ) U7.19(~{CS}) U7.28(GND) U7.41(GND) U7.46(GNDQ) U7.52(GNDQ) U7.54(GND)
VCC_3.3: C27.1 C45.1 C46.1 C49.1 C50.1 C51.1 C54.1 C55.1 C56.1 C57.1 C58.1 C59.1 C61.1 C62.1 U3.1(VDD) U3.3(VDDQ) U3.9(VDDQ) U3.14(VDD) U3.27(VDD) U3.43(VDQQ) U3.49(VDQQ) U7.1(VDD) U7.3(VDDQ) U7.9(VDDQ) U7.14(VDD) U7.27(VDD) U7.43(VDQQ) U7.49(VDQQ)
CFG_CSSPIN: U1.105(PR3A/R_GPLLT_IN) ; port SPI.NSS
CFG_MCLK: U1.99(PR5B) ; port SPI.SCK
CFG_PGMN: U1.61(PB31A) ; port FPGA_CFG.PROGRAMN
CFG_SISPI: U1.73(PR24B) ; port SPI.MOSI
CFG_SPISO: U1.98(PR7A) ; port SPI.MISO
FPGA_CLK: R28.1
FSMC_A16: U1.59(PB29A) ; port FSMC_BUS.A16
FSMC_CLK: U1.55(PB23A/PCLKT2_1) ; port FSMC_BUS.CLK
FSMC_D0: U1.62(PB31B) ; port FSMC_BUS.AD0
FSMC_D1: U1.63(PB31D) ; port FSMC_BUS.AD1
FSMC_D2: U1.65(PB35A) ; port FSMC_BUS.AD2
FSMC_D3: U1.67(PB35B) ; port FSMC_BUS.AD3
FSMC_D4: U1.39(PB4B) ; port FSMC_BUS.AD4
FSMC_D5: U1.40(PB6A/CSSPIN) ; port FSMC_BUS.AD5
FSMC_D6: U1.41(PB6B) ; port FSMC_BUS.AD6
FSMC_D7: U1.42(PB9A) ; port FSMC_BUS.AD7
FSMC_D8: U1.43(PB9B) ; port FSMC_BUS.AD8
FSMC_D9: U1.44(PB12A/MCLK/CCLK) ; port FSMC_BUS.AD9
FSMC_D10: U1.48(PB13B) ; port FSMC_BUS.AD10
FSMC_D11: U1.49(PB16A/PCLKT2_0) ; port FSMC_BUS.AD11
FSMC_D12: U1.54(PB18B) ; port FSMC_BUS.AD12
FSMC_D13: U1.56(PB23B/PCLKC2_1) ; port FSMC_BUS.AD13
FSMC_D14: U1.57(PB26A) ; port FSMC_BUS.AD14
FSMC_D15: U1.58(PB26B) ; port FSMC_BUS.AD15
FSMC_NCE: U1.71(PB38B/SI/SISPI) ; port FSMC_BUS.NCE
FSMC_NOE: U1.69(PB37B) ; port FSMC_BUS.NOE
FSMC_NWE: U1.70(PB38A/SN) ; port FSMC_BUS.NWE
SDIO_D1: R28.2 ; port CLK
SRAM_A0: U1.113(PT33B) U3.23(A0) U7.23(A0)
SRAM_A1: U1.114(PT33A) U3.24(A1) U7.24(A1)
SRAM_A2: U1.115(PT28B) U3.25(A2) U7.25(A2)
SRAM_A3: U1.117(PT28A) U3.26(A3) U7.26(A3)
SRAM_A4: U3.29(A4) U7.29(A4)
SRAM_A5: U1.143(PT9A) U3.30(A5) U7.30(A5)
SRAM_A6: U1.142(PT9B) U3.31(A6) U7.31(A6)
SRAM_A7: U1.141(PT10A) U3.32(A7) U7.32(A7)
SRAM_A8: U1.140(PT10B) U3.33(A8) U7.33(A8)
SRAM_A9: U1.139(PT11A) U3.34(A9) U7.34(A9)
SRAM_A10: U1.112(PT35A) U3.22(A10/AP) U7.22(A10/AP)
SRAM_A11: U1.138(PT11B) U3.35(A11) U7.35(A11)
SRAM_A12: U1.137(PT14C/TDO)
SRAM_BA0: U1.110(PT36C/INITN) U3.20(BA0) U7.20(BA0)
SRAM_BA1: U1.111(PT35B) U3.21(BA1) U7.21(BA1)
SRAM_CAS: U1.75(PR23B) U3.17(~{CAS}) U7.17(~{CAS})
SRAM_CKE: U1.136(PT14D/TDI) U3.37(CKE) U7.37(CKE)
SRAM_CLK: U1.133(PT15A) U3.38(CLK) U7.38(CLK)
SRAM_CS: U1.109(PT36D/DONE)
SRAM_DQ0: U1.89(PR15A) U3.2(DQ0)
SRAM_DQ1: U1.87(PR15B) U3.4(DQ1)
SRAM_DQ2: U1.86(PR16A) U3.5(DQ2)
SRAM_DQ3: U1.85(PR16B) U3.7(DQ3)
SRAM_DQ4: U1.84(PR17A) U3.8(DQ4)
SRAM_DQ5: U1.83(PR17B) U3.10(DQ5)
SRAM_DQ6: U1.82(PR18A) U3.11(DQ6)
SRAM_DQ7: U1.81(PR18B) U3.13(DQ7)
SRAM_DQ8: U1.128(PT18A/PCLKT0_1) U3.42(DQ8)
SRAM_DQ9: U1.127(PT18B/PCLKC0_1) U3.44(DQ9)
SRAM_DQ10: U1.126(PT22C/SCL/PCLKT0_0) U3.45(DQ10)
SRAM_DQ11: U1.125(PT22D/SDA/PCLKC0_0) U3.47(DQ11)
SRAM_DQ12: U1.122(PT25A) U3.48(DQ12)
SRAM_DQ13: U1.121(PT25B) U3.50(DQ13)
SRAM_DQ14: U1.120(PT27C/JTAGENB) U3.51(DQ14)
SRAM_DQ15: U1.119(PT27D/PROGRAMN) U3.53(DQ15)
SRAM_DQ16: U7.2(DQ0)
SRAM_DQ17: U7.4(DQ1)
SRAM_DQ18: U7.5(DQ2)
SRAM_DQ19: U7.7(DQ3)
SRAM_DQ20: U7.8(DQ4)
SRAM_DQ21: U7.10(DQ5)
SRAM_DQ22: U7.11(DQ6)
SRAM_DQ23: U7.13(DQ7)
SRAM_DQ24: U7.42(DQ8)
SRAM_DQ25: U7.44(DQ9)
SRAM_DQ26: U7.45(DQ10)
SRAM_DQ27: U7.47(DQ11)
SRAM_DQ28: U7.48(DQ12)
SRAM_DQ29: U7.50(DQ13)
SRAM_DQ30: U7.51(DQ14)
SRAM_DQ31: U7.53(DQ15)
SRAM_DQM: U1.78(PR21A)
SRAM_DQM1: U3.15(LDQM) U3.39(UDQM)
SRAM_DQM2: U7.15(LDQM) U7.39(UDQM)
SRAM_RAS: U1.74(PR24A) U3.18(~{RAS}) U7.18(~{RAS})
SRAM_WE1: U1.76(PR23A) U3.16(~{WE})
SRAM_WE2: U7.16(~{WE})

Not connected (* = marked no-connect by the designer): U1 1(PL3A/L_GPLLT_FB) 2(PL3B/L_GPLLC_FB) 3(PL4A/L_GPLLT_IN) 4(PL4B/L_GPLLC_IN) 5(PL6A/PCLKT5_0) 6(PL6B/PCLKC5_0) 9(PL8A) 10(PL8B) 11(PL9A) 12(PL9B) 13(PL10A) 14(PL10B) 15(PL11A) 17(PL11B) 19(PL12A/PCLKT4_0) 20(PL12B/PCLKC4_0) 21(PL15A) 22(PL15B) 23(PL17A) 24(PL17B) 25(PL19A) 26(PL19B) 27(PL22A/PCLKT3_0) 28(PL22B/PCLKC3_0) 31(PL23D) 32(PL24A) 33(PL24B) 34(PL25A) 35(PL25B) 38(PB4A) 45(PB12B/SO/SPISO) 47(PB13A) 50(PB16B/PCLKC2_0) 52(PB18A) 60(PB29B) 68(PB37A) 77(PR21B) 91(PR12B/PCLKC1_0) 92(PR12A/PCLKT1_0) 93(PR11B) 94(PR11A) 95(PR9B) 96(PR9A) 97(PR7B) 100(PR5A) 103(PR4C) 104(PR3B/R_GPLLC_IN) 106(PR2B/R_GPLLC_FB) 107(PR2A/R_GPLLT_FB) 130(PT17D/TMS) 131(PT17C/TCK) 132(PT15B)

### Buses and harness runs
bus SRAM_A[0..12]
bus SRAM_DQ[0..31]

### Layout directives
rule Matched Net Lengths [Tolerance = 10mm]: (no net found under the mark)

### Notes on the sheet
- TITLE
- CHK
- DWN
- APV
- DWG
- REV
- File:
- Sheet
- of
- (in symbol LCMXO2-7000HC, part B) Bank 0
- (in symbol LCMXO2-7000HC, part C) Bank 1
- (in symbol LCMXO2-7000HC, part D) Bank 2
- (in symbol LCMXO2-7000HC, part E) Bank 3
- (in symbol LCMXO2-7000HC, part F) Bank 4
- (in symbol LCMXO2-7000HC, part G) Bank 5

### Library data of the parts
C27 C45 C46 C49-C51 C54-C59 C61 C62 = C0603: as C5 on sheet yard-ice-2-toplevel; PN: 000500; Package: 0603
R28 = R0603: SMD Chip Resistor - 0603; PN: 000501
U1 = LCMXO2-7000HC: FPGA, 6864 Logic Elements, Flash; MF: Lattice; Digy-Key PN: 220-1567-ND; PN: 000000; Package: 144-LQFP; ExtraInfo: *; MF PN: LCMXO2-7000HC-4TG144C
U3 U7 = IS42S16160J-7TL: 256Mbit (16M x16) 143MHz SDRAM; MF: ISSI; PN: 000000; Package: 54-TSOP II; ExtraInfo: *

## Sheet yard-ice-fpga-pwr.SchDoc: Yard-Ice-FPGA
size 365 x 274 mm; Revision: 1.0; SheetNumber: 4; SheetTotal: 5
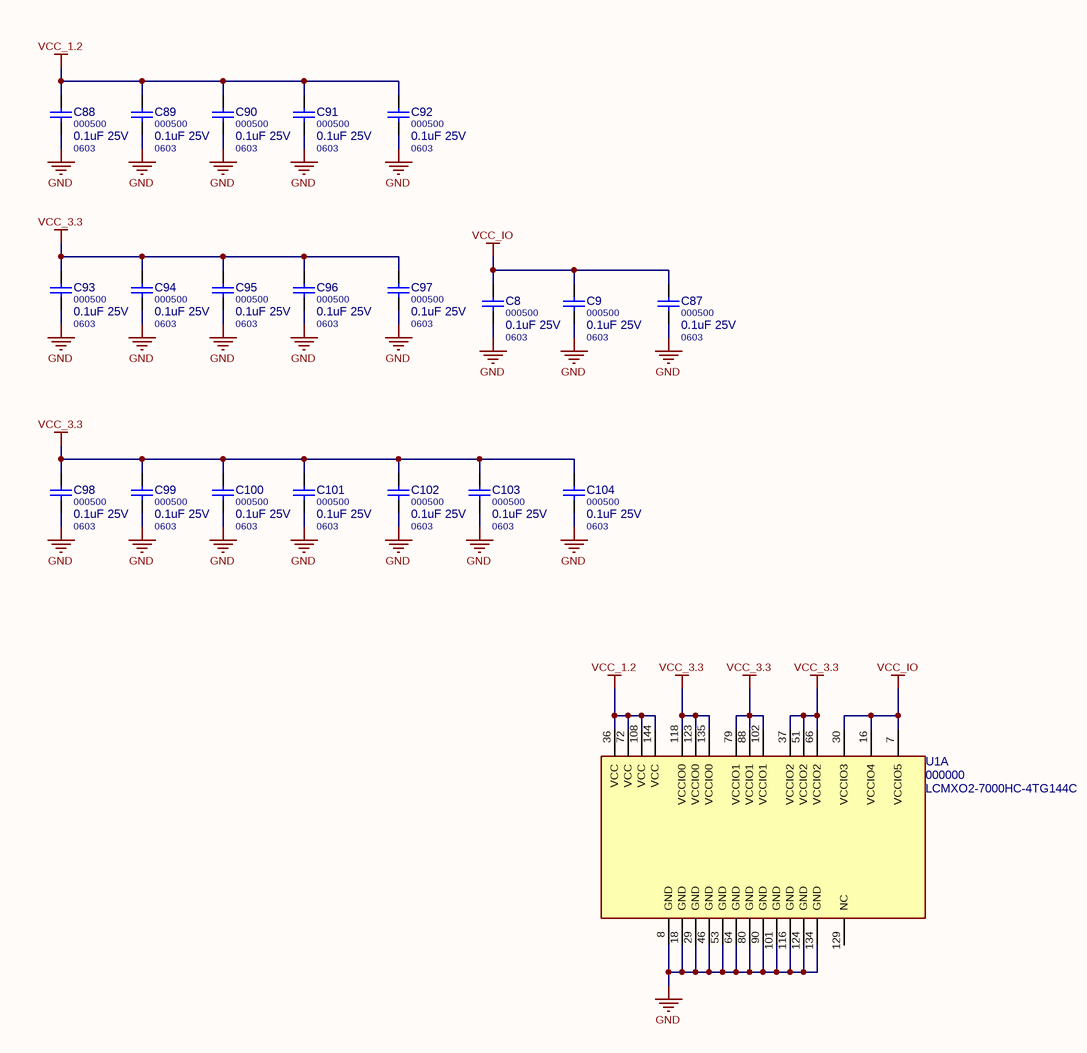
[diagram p3: yard-ice-fpga-pwr.SchDoc]

### Parts
C8  000500  value 0.1uF 25V  Package: 0603  [C0603M]
C9  000500  value 0.1uF 25V  Package: 0603  [C0603M]
C87  000500  value 0.1uF 25V  Package: 0603  [C0603M]
C88  000500  value 0.1uF 25V  Package: 0603  [C0603M]
C89  000500  value 0.1uF 25V  Package: 0603  [C0603M]
C90  000500  value 0.1uF 25V  Package: 0603  [C0603M]
C91  000500  value 0.1uF 25V  Package: 0603  [C0603M]
C92  000500  value 0.1uF 25V  Package: 0603  [C0603M]
C93  000500  value 0.1uF 25V  Package: 0603  [C0603M]
C94  000500  value 0.1uF 25V  Package: 0603  [C0603M]
C95  000500  value 0.1uF 25V  Package: 0603  [C0603M]
C96  000500  value 0.1uF 25V  Package: 0603  [C0603M]
C97  000500  value 0.1uF 25V  Package: 0603  [C0603M]
C98  000500  value 0.1uF 25V  Package: 0603  [C0603M]
C99  000500  value 0.1uF 25V  Package: 0603  [C0603M]
C100  000500  value 0.1uF 25V  Package: 0603  [C0603M]
C101  000500  value 0.1uF 25V  Package: 0603  [C0603M]
C102  000500  value 0.1uF 25V  Package: 0603  [C0603M]
C103  000500  value 0.1uF 25V  Package: 0603  [C0603M]
C104  000500  value 0.1uF 25V  Package: 0603  [C0603M]
U1  000000  value LCMXO2-7000HC-4TG144C  [144-TQFP]  (part A of 7)

### Nets
GND: C8.2 C9.2 C87.2 C88.2 C89.2 C90.2 C91.2 C92.2 C93.2 C94.2 C95.2 C96.2 C97.2 C98.2 C99.2 C100.2 C101.2 C102.2 C103.2 C104.2 U1.8(GND) U1.18(GND) U1.29(GND) U1.46(GND) U1.53(GND) U1.64(GND) U1.80(GND) U1.90(GND) U1.101(GND) U1.116(GND) U1.124(GND) U1.134(GND)
VCC_1.2: C88.1 C89.1 C90.1 C91.1 C92.1 U1.36(VCC) U1.72(VCC) U1.108(VCC) U1.144(VCC)
VCC_3.3: C93.1 C94.1 C95.1 C96.1 C97.1 C98.1 C99.1 C100.1 C101.1 C102.1 C103.1 C104.1 U1.37(VCCIO2) U1.51(VCCIO2) U1.66(VCCIO2) U1.79(VCCIO1) U1.88(VCCIO1) U1.102(VCCIO1) U1.118(VCCIO0) U1.123(VCCIO0) U1.135(VCCIO0)
VCC_IO: C8.1 C9.1 C87.1 U1.7(VCCIO5) U1.16(VCCIO4) U1.30(VCCIO3)

Not connected (* = marked no-connect by the designer): U1 129(NC)

### Notes on the sheet
- TITLE
- CHK
- DWN
- APV
- DWG
- REV
- File:
- Sheet
- of

### Library data of the parts
C8 C9 C87-C104 = C0603: as C5 on sheet yard-ice-2-toplevel; PN: 000500
U1 = LCMXO2-7000HC: as U1 on sheet yard-ice-2-fpga; PN: 000000; Package: 144-LQFP; ExtraInfo: *; MF PN: LCMXO2-7000HC-4TG144C

## Sheet yard-ice-change-log.SchDoc: Yard-Ice-Power
size 365 x 274 mm; Revision: 1.0; SheetNumber: 2; SheetTotal: 5
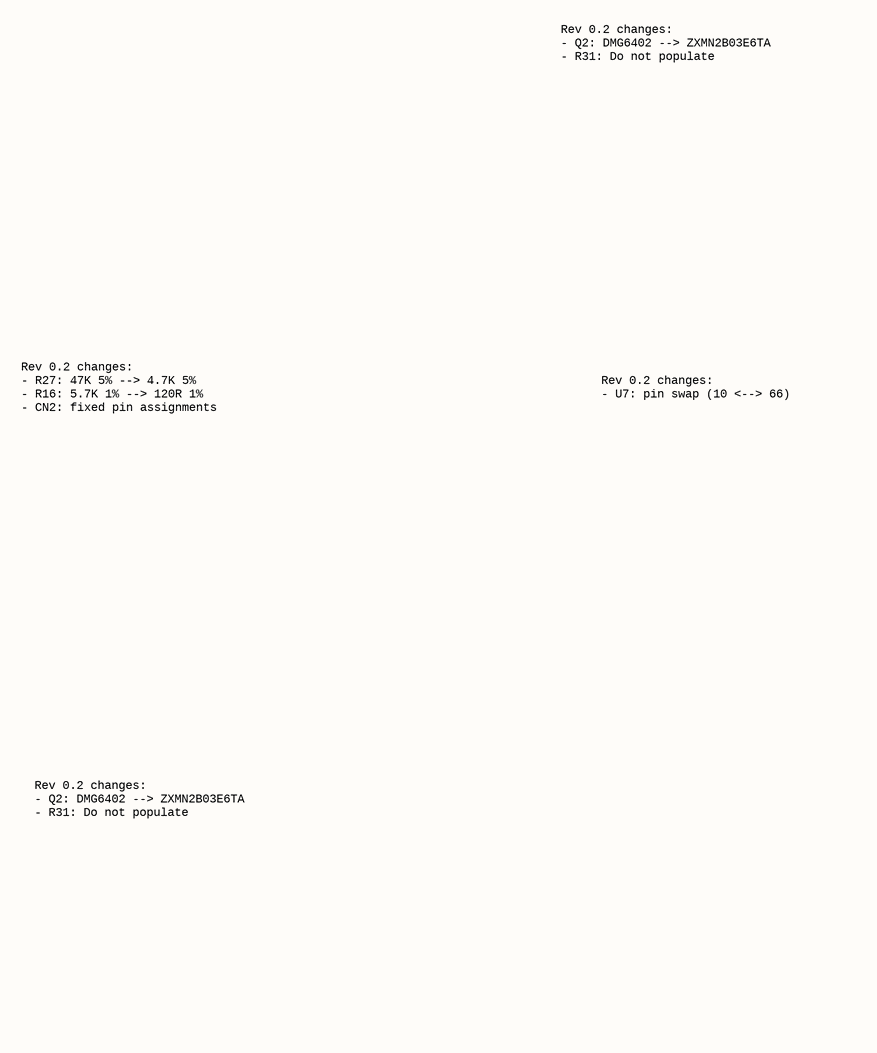
[diagram p4: yard-ice-change-log.SchDoc]

### Notes on the sheet
- Rev 0.2 changes:
  - Q2: DMG6402 --> ZXMN2B03E6TA
  - R31: Do not populate
- Rev 0.2 changes:
  - R27: 47K 5% --> 4.7K 5%
  - R16: 5.7K 1% --> 120R 1%
  - CN2: fixed pin assignments
- Rev 0.2 changes:
  - U7: pin swap (10 <--> 66)
- TITLE
- CHK
- DWN
- APV
- DWG
- REV
- File:
- Sheet
- of

## Nets that join several sheets
GND: yard-ice-2-toplevel (30 pins), yard-ice-cpu (27 pins), yard-ice-2-fpga (30 pins), yard-ice-fpga-pwr (32 pins)
VCC_3.3: yard-ice-2-toplevel (6 pins), yard-ice-cpu (19 pins), yard-ice-2-fpga (28 pins), yard-ice-fpga-pwr (21 pins)
VCC_IO: yard-ice-2-toplevel (CN4.2), yard-ice-fpga-pwr (6 pins)
CFG_PGMN: yard-ice-cpu (U6.97), yard-ice-2-fpga (U1.61)
FSMC_A16: yard-ice-cpu (U6.58), yard-ice-2-fpga (U1.59)
FSMC_CLK: yard-ice-cpu (U6.84), yard-ice-2-fpga (U1.55)
FSMC_D0: yard-ice-cpu (U6.61), yard-ice-2-fpga (U1.62)
FSMC_D1: yard-ice-cpu (U6.62), yard-ice-2-fpga (U1.63)
FSMC_D2: yard-ice-cpu (U6.81), yard-ice-2-fpga (U1.65)
FSMC_D3: yard-ice-cpu (U6.82), yard-ice-2-fpga (U1.67)
FSMC_D4: yard-ice-cpu (U6.38), yard-ice-2-fpga (U1.39)
FSMC_D5: yard-ice-cpu (U6.39), yard-ice-2-fpga (U1.40)
FSMC_D6: yard-ice-cpu (U6.40), yard-ice-2-fpga (U1.41)
FSMC_D7: yard-ice-cpu (U6.41), yard-ice-2-fpga (U1.42)
FSMC_D8: yard-ice-cpu (U6.42), yard-ice-2-fpga (U1.43)
FSMC_D9: yard-ice-cpu (U6.43), yard-ice-2-fpga (U1.44)
FSMC_D10: yard-ice-cpu (U6.44), yard-ice-2-fpga (U1.48)
FSMC_D11: yard-ice-cpu (U6.45), yard-ice-2-fpga (U1.49)
FSMC_D12: yard-ice-cpu (U6.46), yard-ice-2-fpga (U1.54)
FSMC_D13: yard-ice-cpu (U6.55), yard-ice-2-fpga (U1.56)
FSMC_D14: yard-ice-cpu (U6.56), yard-ice-2-fpga (U1.57)
FSMC_D15: yard-ice-cpu (U6.57), yard-ice-2-fpga (U1.58)
FSMC_NCE: yard-ice-cpu (U6.88), yard-ice-2-fpga (U1.71)
FSMC_NOE: yard-ice-cpu (U6.85), yard-ice-2-fpga (U1.69)
FSMC_NWE: yard-ice-cpu (U6.86), yard-ice-2-fpga (U1.70)
JTCK: yard-ice-2-toplevel (P3.7), yard-ice-cpu (U6.72)
JTDI: yard-ice-2-toplevel (P3.3), yard-ice-cpu (U6.77)
JTDO: yard-ice-2-toplevel (P3.5), yard-ice-cpu (U6.89)
JTMS: yard-ice-2-toplevel (P3.1), yard-ice-cpu (U6.76)
JTRST: yard-ice-2-toplevel (P3.9), yard-ice-cpu (U6.90)
NRST: yard-ice-2-toplevel (P3.4), yard-ice-cpu (U6.14)
OTG_FS_DM: yard-ice-2-toplevel (U19.3), yard-ice-cpu (U6.70)
OTG_FS_DP: yard-ice-2-toplevel (U19.1), yard-ice-cpu (U6.71)
OTG_FS_VBUS: yard-ice-2-toplevel (C5.1 FB1.2), yard-ice-cpu (U6.68)
SDIO_CK: yard-ice-2-toplevel (U10.5), yard-ice-cpu (U6.80 U6.91)
SDIO_D1: yard-ice-cpu (U6.66), yard-ice-2-fpga (R28.2)
SDIO_D2: yard-ice-2-toplevel (U10.6), yard-ice-cpu (U6.78)
SDIO_D3: yard-ice-2-toplevel (U10.2), yard-ice-cpu (U6.79)
SPI2_NSS: yard-ice-2-toplevel (Q1.1), yard-ice-cpu (U6.96)